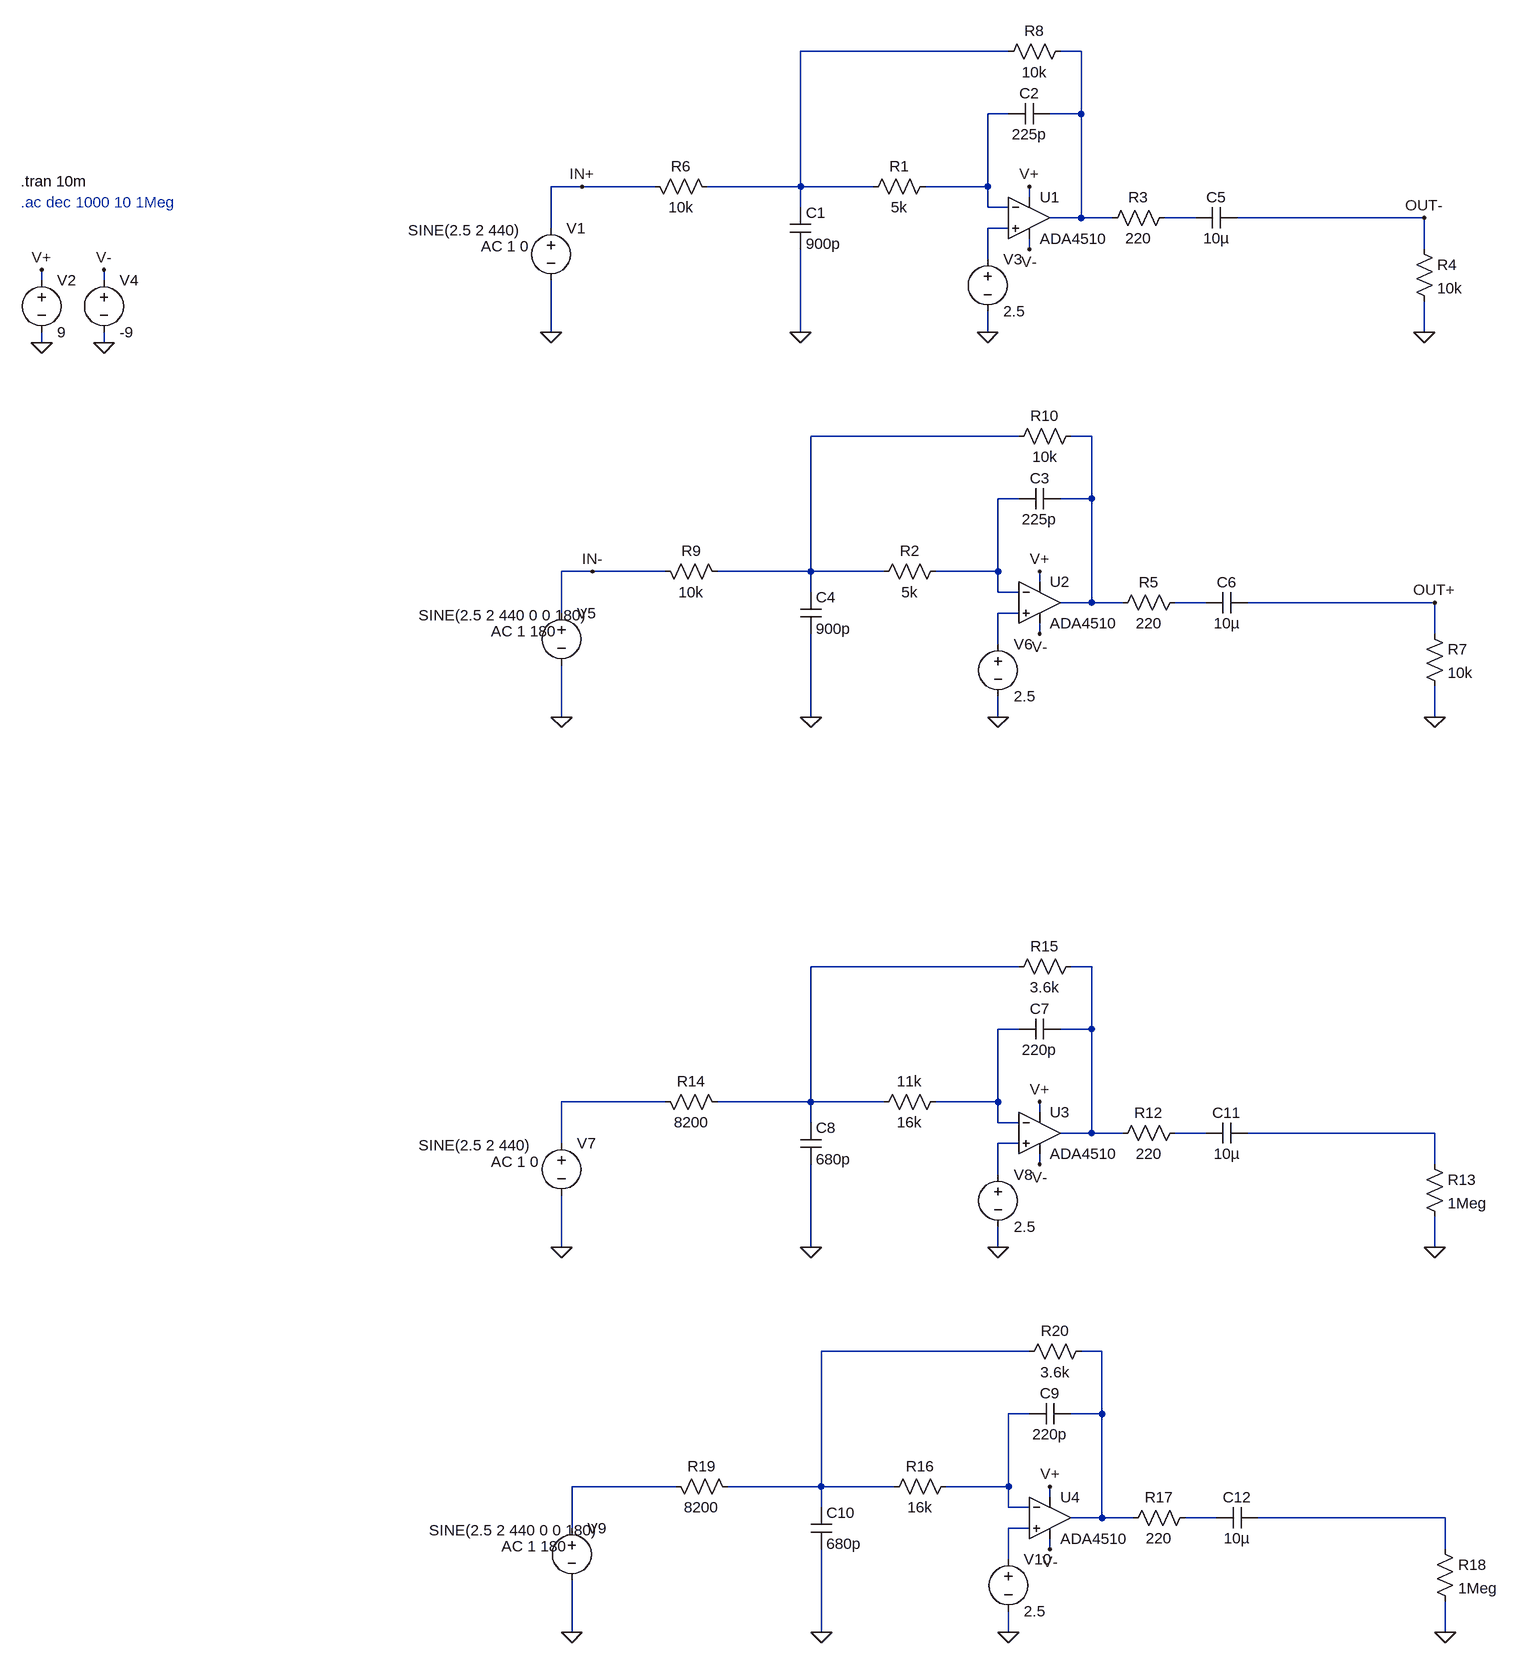
[diagram p0: schematic MFB.asc]
MFB.asc, the LTspice schematic file:
Version 4
SHEET 1 1160 2260
WIRE 400 -192 80 -192
WIRE 512 -192 480 -192
WIRE 400 -96 368 -96
WIRE 512 -96 512 -192
WIRE 512 -96 464 -96
WIRE -256 16 -304 16
WIRE -144 16 -256 16
WIRE 80 16 80 -192
WIRE 80 16 -64 16
WIRE 192 16 80 16
WIRE 368 16 368 -96
WIRE 368 16 272 16
WIRE 432 32 432 16
WIRE 80 48 80 16
WIRE 368 48 368 16
WIRE 400 48 368 48
WIRE 512 64 512 -96
WIRE 512 64 464 64
WIRE 560 64 512 64
WIRE 688 64 640 64
WIRE 1040 64 752 64
WIRE -304 80 -304 16
WIRE 400 80 368 80
WIRE 432 112 432 96
WIRE 1040 112 1040 64
WIRE 368 128 368 80
WIRE -1088 160 -1088 144
WIRE -992 160 -992 144
WIRE -304 240 -304 160
WIRE 80 240 80 112
WIRE 368 240 368 208
WIRE 1040 240 1040 192
WIRE -1088 256 -1088 240
WIRE -992 256 -992 240
WIRE 416 400 96 400
WIRE 528 400 496 400
WIRE 416 496 384 496
WIRE 528 496 528 400
WIRE 528 496 480 496
WIRE -240 608 -288 608
WIRE -128 608 -240 608
WIRE 96 608 96 400
WIRE 96 608 -48 608
WIRE 208 608 96 608
WIRE 384 608 384 496
WIRE 384 608 288 608
WIRE 448 624 448 608
WIRE 96 640 96 608
WIRE 384 640 384 608
WIRE 416 640 384 640
WIRE 528 656 528 496
WIRE 528 656 480 656
WIRE 576 656 528 656
WIRE 704 656 656 656
WIRE 1056 656 768 656
WIRE -288 672 -288 608
WIRE 416 672 384 672
WIRE 448 704 448 688
WIRE 1056 704 1056 656
WIRE 384 720 384 672
WIRE -288 832 -288 752
WIRE 96 832 96 704
WIRE 384 832 384 800
WIRE 1056 832 1056 784
WIRE 416 1216 96 1216
WIRE 528 1216 496 1216
WIRE 416 1312 384 1312
WIRE 528 1312 528 1216
WIRE 528 1312 480 1312
WIRE -128 1424 -288 1424
WIRE 96 1424 96 1216
WIRE 96 1424 -48 1424
WIRE 208 1424 96 1424
WIRE 384 1424 384 1312
WIRE 384 1424 288 1424
WIRE 448 1440 448 1424
WIRE 96 1456 96 1424
WIRE 384 1456 384 1424
WIRE 416 1456 384 1456
WIRE 528 1472 528 1312
WIRE 528 1472 480 1472
WIRE 576 1472 528 1472
WIRE 704 1472 656 1472
WIRE 1056 1472 768 1472
WIRE -288 1488 -288 1424
WIRE 416 1488 384 1488
WIRE 448 1520 448 1504
WIRE 1056 1520 1056 1472
WIRE 384 1536 384 1488
WIRE -288 1648 -288 1568
WIRE 96 1648 96 1520
WIRE 384 1648 384 1616
WIRE 1056 1648 1056 1600
WIRE 432 1808 112 1808
WIRE 544 1808 512 1808
WIRE 432 1904 400 1904
WIRE 544 1904 544 1808
WIRE 544 1904 496 1904
WIRE -112 2016 -272 2016
WIRE 112 2016 112 1808
WIRE 112 2016 -32 2016
WIRE 224 2016 112 2016
WIRE 400 2016 400 1904
WIRE 400 2016 304 2016
WIRE 464 2032 464 2016
WIRE 112 2048 112 2016
WIRE 400 2048 400 2016
WIRE 432 2048 400 2048
WIRE 544 2064 544 1904
WIRE 544 2064 496 2064
WIRE 592 2064 544 2064
WIRE 720 2064 672 2064
WIRE 1072 2064 784 2064
WIRE -272 2080 -272 2016
WIRE 432 2080 400 2080
WIRE 464 2112 464 2096
WIRE 1072 2112 1072 2064
WIRE 400 2128 400 2080
WIRE -272 2240 -272 2160
WIRE 112 2240 112 2112
WIRE 400 2240 400 2208
WIRE 1072 2240 1072 2192
FLAG -1088 256 0
FLAG -1088 144 V+
FLAG 432 16 V+
FLAG 1040 240 0
FLAG -304 240 0
FLAG 432 112 V-
FLAG -992 256 0
FLAG -992 144 V-
FLAG 80 240 0
FLAG 368 240 0
FLAG -256 16 IN+
FLAG 448 608 V+
FLAG 1056 832 0
FLAG -288 832 0
FLAG 448 704 V-
FLAG 96 832 0
FLAG 384 832 0
FLAG -240 608 IN-
FLAG 1040 64 OUT-
FLAG 1056 656 OUT+
FLAG 448 1424 V+
FLAG 1056 1648 0
FLAG -288 1648 0
FLAG 448 1520 V-
FLAG 96 1648 0
FLAG 384 1648 0
FLAG 464 2016 V+
FLAG 1072 2240 0
FLAG -272 2240 0
FLAG 464 2112 V-
FLAG 112 2240 0
FLAG 400 2240 0
SYMBOL voltage -304 64 R0
WINDOW 3 -220 19 Left 2
WINDOW 123 -108 44 Left 2
WINDOW 39 0 0 Left 0
SYMATTR Value SINE(2.5 2 440)
SYMATTR Value2 AC 1 0
SYMATTR InstName V1
SYMBOL voltage -1088 144 R0
WINDOW 123 0 0 Left 0
WINDOW 39 0 0 Left 0
SYMATTR InstName V2
SYMATTR Value 9
SYMBOL OpAmps\\ADA4510 432 0 R0
SYMATTR InstName U1
SYMBOL res 288 0 R90
WINDOW 0 0 56 VBottom 2
WINDOW 3 32 56 VTop 2
SYMATTR InstName R1
SYMATTR Value 5k
SYMBOL cap 464 -112 R90
WINDOW 0 0 32 VBottom 2
WINDOW 3 32 32 VTop 2
SYMATTR InstName C2
SYMATTR Value 225p
SYMBOL res 656 48 R90
WINDOW 0 0 56 VBottom 2
WINDOW 3 32 56 VTop 2
SYMATTR InstName R3
SYMATTR Value 220
SYMBOL res 1024 96 R0
SYMATTR InstName R4
SYMATTR Value 10k
SYMBOL res -160 0 M90
WINDOW 0 0 56 VBottom 2
WINDOW 3 32 56 VTop 2
SYMATTR InstName R6
SYMATTR Value 10k
SYMBOL res 496 -208 R90
WINDOW 0 0 56 VBottom 2
WINDOW 3 32 56 VTop 2
SYMATTR InstName R8
SYMATTR Value 10k
SYMBOL voltage -992 144 R0
WINDOW 123 0 0 Left 0
WINDOW 39 0 0 Left 0
SYMATTR InstName V4
SYMATTR Value -9
SYMBOL cap 64 48 R0
SYMATTR InstName C1
SYMATTR Value 900p
SYMBOL voltage 368 112 R0
WINDOW 123 0 0 Left 0
WINDOW 39 0 0 Left 0
SYMATTR InstName V3
SYMATTR Value 2.5
SYMBOL voltage -288 656 R0
WINDOW 3 -220 19 Left 2
WINDOW 123 -108 44 Left 2
WINDOW 39 0 0 Left 0
SYMATTR Value SINE(2.5 2 440 0 0 180)
SYMATTR Value2 AC 1 180
SYMATTR InstName V5
SYMBOL OpAmps\\ADA4510 448 592 R0
SYMATTR InstName U2
SYMBOL res 304 592 R90
WINDOW 0 0 56 VBottom 2
WINDOW 3 32 56 VTop 2
SYMATTR InstName R2
SYMATTR Value 5k
SYMBOL cap 480 480 R90
WINDOW 0 0 32 VBottom 2
WINDOW 3 32 32 VTop 2
SYMATTR InstName C3
SYMATTR Value 225p
SYMBOL res 672 640 R90
WINDOW 0 0 56 VBottom 2
WINDOW 3 32 56 VTop 2
SYMATTR InstName R5
SYMATTR Value 220
SYMBOL res 1040 688 R0
SYMATTR InstName R7
SYMATTR Value 10k
SYMBOL res -144 592 M90
WINDOW 0 0 56 VBottom 2
WINDOW 3 32 56 VTop 2
SYMATTR InstName R9
SYMATTR Value 10k
SYMBOL res 512 384 R90
WINDOW 0 0 56 VBottom 2
WINDOW 3 32 56 VTop 2
SYMATTR InstName R10
SYMATTR Value 10k
SYMBOL cap 80 640 R0
SYMATTR InstName C4
SYMATTR Value 900p
SYMBOL voltage 384 704 R0
WINDOW 123 0 0 Left 0
WINDOW 39 0 0 Left 0
SYMATTR InstName V6
SYMATTR Value 2.5
SYMBOL cap 752 48 R90
WINDOW 0 0 32 VBottom 2
WINDOW 3 32 32 VTop 2
SYMATTR InstName C5
SYMATTR Value 10µ
SYMBOL cap 768 640 R90
WINDOW 0 0 32 VBottom 2
WINDOW 3 32 32 VTop 2
SYMATTR InstName C6
SYMATTR Value 10µ
SYMBOL voltage -288 1472 R0
WINDOW 3 -220 19 Left 2
WINDOW 123 -108 44 Left 2
WINDOW 39 0 0 Left 0
SYMATTR Value SINE(2.5 2 440)
SYMATTR Value2 AC 1 0
SYMATTR InstName V7
SYMBOL OpAmps\\ADA4510 448 1408 R0
SYMATTR InstName U3
SYMBOL res 304 1408 R90
WINDOW 0 0 56 VBottom 2
WINDOW 3 32 56 VTop 2
SYMATTR InstName 11k
SYMATTR Value 16k
SYMBOL cap 480 1296 R90
WINDOW 0 0 32 VBottom 2
WINDOW 3 32 32 VTop 2
SYMATTR InstName C7
SYMATTR Value 220p
SYMBOL res 672 1456 R90
WINDOW 0 0 56 VBottom 2
WINDOW 3 32 56 VTop 2
SYMATTR InstName R12
SYMATTR Value 220
SYMBOL res 1040 1504 R0
SYMATTR InstName R13
SYMATTR Value 1Meg
SYMBOL res -144 1408 M90
WINDOW 0 0 56 VBottom 2
WINDOW 3 32 56 VTop 2
SYMATTR InstName R14
SYMATTR Value 8200
SYMBOL res 512 1200 R90
WINDOW 0 0 56 VBottom 2
WINDOW 3 32 56 VTop 2
SYMATTR InstName R15
SYMATTR Value 3.6k
SYMBOL cap 80 1456 R0
SYMATTR InstName C8
SYMATTR Value 680p
SYMBOL voltage 384 1520 R0
WINDOW 123 0 0 Left 0
WINDOW 39 0 0 Left 0
SYMATTR InstName V8
SYMATTR Value 2.5
SYMBOL voltage -272 2064 R0
WINDOW 3 -220 19 Left 2
WINDOW 123 -108 44 Left 2
WINDOW 39 0 0 Left 0
SYMATTR Value SINE(2.5 2 440 0 0 180)
SYMATTR Value2 AC 1 180
SYMATTR InstName V9
SYMBOL OpAmps\\ADA4510 464 2000 R0
SYMATTR InstName U4
SYMBOL res 320 2000 R90
WINDOW 0 0 56 VBottom 2
WINDOW 3 32 56 VTop 2
SYMATTR InstName R16
SYMATTR Value 16k
SYMBOL cap 496 1888 R90
WINDOW 0 0 32 VBottom 2
WINDOW 3 32 32 VTop 2
SYMATTR InstName C9
SYMATTR Value 220p
SYMBOL res 688 2048 R90
WINDOW 0 0 56 VBottom 2
WINDOW 3 32 56 VTop 2
SYMATTR InstName R17
SYMATTR Value 220
SYMBOL res 1056 2096 R0
SYMATTR InstName R18
SYMATTR Value 1Meg
SYMBOL res -128 2000 M90
WINDOW 0 0 56 VBottom 2
WINDOW 3 32 56 VTop 2
SYMATTR InstName R19
SYMATTR Value 8200
SYMBOL res 528 1792 R90
WINDOW 0 0 56 VBottom 2
WINDOW 3 32 56 VTop 2
SYMATTR InstName R20
SYMATTR Value 3.6k
SYMBOL cap 96 2048 R0
SYMATTR InstName C10
SYMATTR Value 680p
SYMBOL voltage 400 2112 R0
WINDOW 123 0 0 Left 0
WINDOW 39 0 0 Left 0
SYMATTR InstName V10
SYMATTR Value 2.5
SYMBOL cap 768 1456 R90
WINDOW 0 0 32 VBottom 2
WINDOW 3 32 32 VTop 2
SYMATTR InstName C11
SYMATTR Value 10µ
SYMBOL cap 784 2048 R90
WINDOW 0 0 32 VBottom 2
WINDOW 3 32 32 VTop 2
SYMATTR InstName C12
SYMATTR Value 10µ
TEXT -1120 8 Left 2 !.tran 10m
TEXT -1120 40 Left 2 ;.ac dec 1000 10 1Meg

The netlist it stands for:
* MFB.asc
V1 IN+ 0 SINE(2.5 2 440) AC 1 0
V2 V+ 0 9
XU1 N005 N003 V+ V- N002 ADA4510  ; pins In+ In- V+ V- OUT
R1 N003 N001 5k
C2 N002 N003 225p
R3 N004 N002 220
R4 OUT- 0 10k
R6 IN+ N001 10k
R8 N002 N001 10k
V4 V- 0 -9
C1 N001 0 900p
V3 N005 0 2.5
V5 IN- 0 SINE(2.5 2 440 0 0 180) AC 1 180
XU2 N010 N008 V+ V- N007 ADA4510  ; pins In+ In- V+ V- OUT
R2 N008 N006 5k
C3 N007 N008 225p
R5 N009 N007 220
R7 OUT+ 0 10k
R9 IN- N006 10k
R10 N007 N006 10k
C4 N006 0 900p
V6 N010 0 2.5
C5 OUT- N004 10µ
C6 OUT+ N009 10µ
V7 N014 0 SINE(2.5 2 440) AC 1 0
XU3 N017 N013 V+ V- N012 ADA4510  ; pins In+ In- V+ V- OUT
R§11k N013 N011 16k
C7 N012 N013 220p
R12 N015 N012 220
R13 N016 0 1Meg
R14 N014 N011 8200
R15 N012 N011 3.6k
C8 N011 0 680p
V8 N017 0 2.5
V9 N021 0 SINE(2.5 2 440 0 0 180) AC 1 180
XU4 N024 N020 V+ V- N019 ADA4510  ; pins In+ In- V+ V- OUT
R16 N020 N018 16k
C9 N019 N020 220p
R17 N022 N019 220
R18 N023 0 1Meg
R19 N021 N018 8200
R20 N019 N018 3.6k
C10 N018 0 680p
V10 N024 0 2.5
C11 N016 N015 10µ
C12 N023 N022 10µ
.tran 10m
* .ac dec 1000 10 1Meg
.backanno
.end